# Altium schematic sheet ethernet.SchDoc
size A4; SheetNumber: 4; SheetTotal: 6
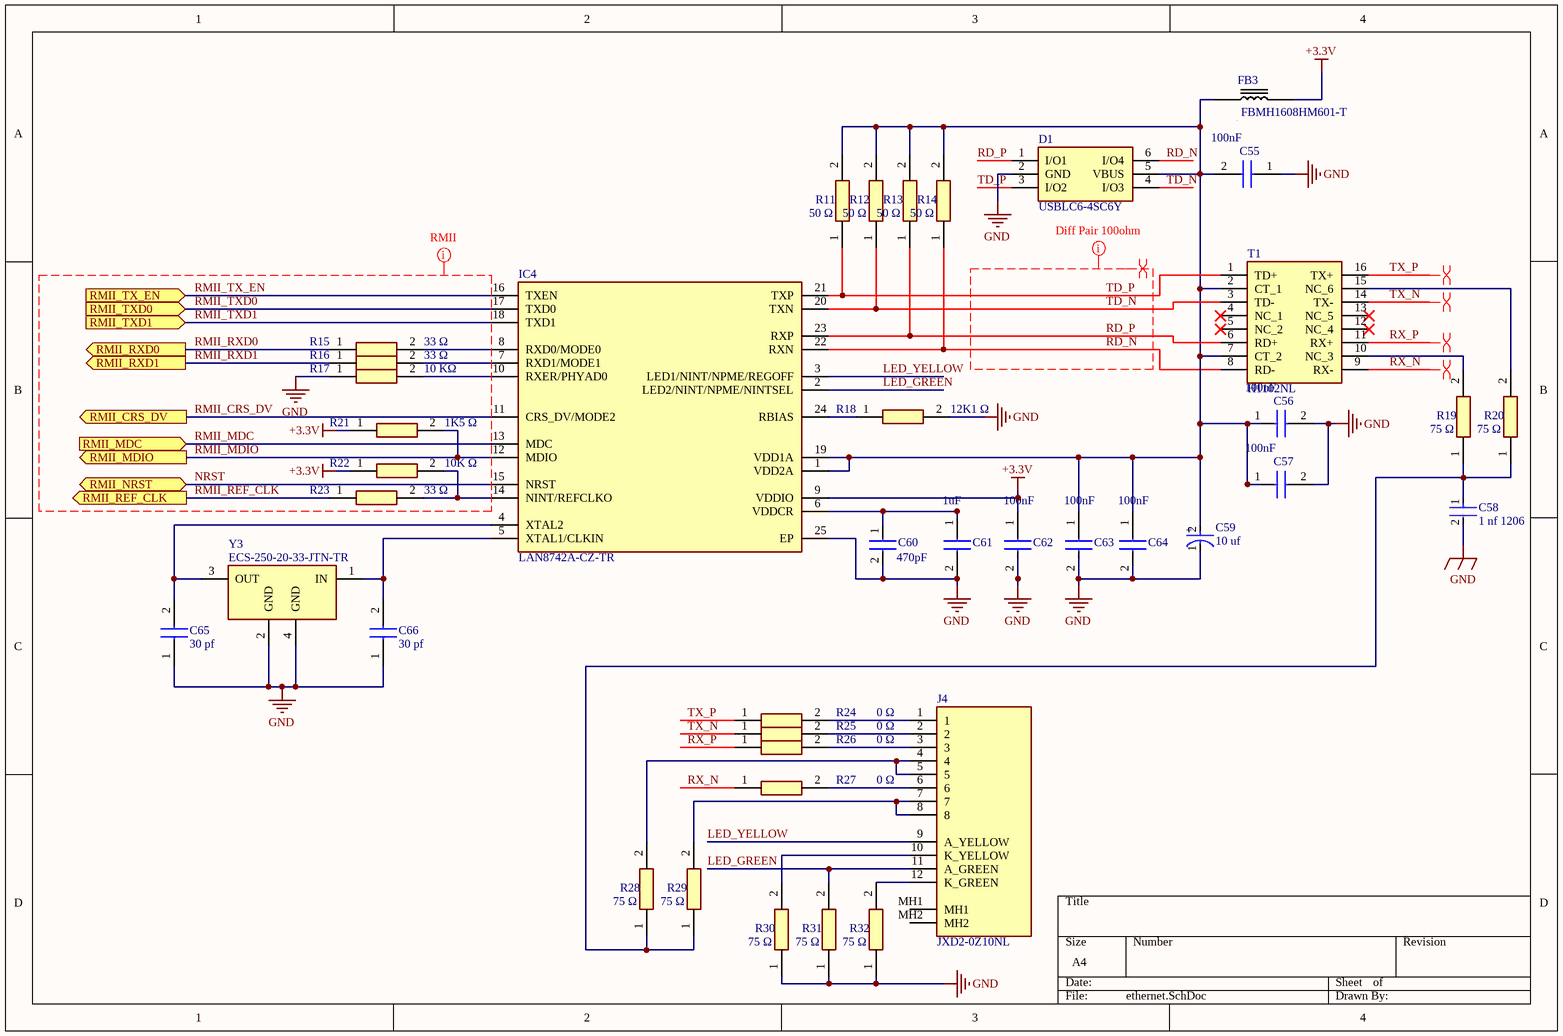
[diagram p0: ethernet.SchDoc]

## Parts
C55  value 100nF  [CAPC1608X87N]  (hidden comment: CGA3E2X7R1H104K080AA)
C56  value 100nF  [CAPC1608X87N]  (hidden comment: CGA3E2X7R1H104K080AA)
C57  value 100nF  [CAPC1608X87N]  (hidden comment: CGA3E2X7R1H104K080AA)
C58  1 nf 1206  [FP-CC1206-0_3-1_45-IPC_C]
C59  10 uf  [FP-T491D-MFG]
C60  value 470pF  [CAPC1005X55N]  (hidden comment: C0603C471J5GACTU)
C61  value 1uF  [CAPC1608X87N]  (hidden comment: 0603ZD105KAT2A)
C62  value 100nF  [CAPC1608X87N]  (hidden comment: CGA3E2X7R1H104K080AA)
C63  value 100nF  [CAPC1608X87N]  (hidden comment: CGA3E2X7R1H104K080AA)
C64  value 100nF  [CAPC1608X87N]  (hidden comment: CGA3E2X7R1H104K080AA)
C65  30 pf  [CAPC1608X87N]
C66  30 pf  [CAPC1608X87N]
D1  USBLC6-4SC6Y  [SOT95P280X145-6N]
FB3  FBMH1608HM601-T  [BEADC1608X90N]
IC4  LAN8742A-CZ-TR  [QFN50P400X400X100-25N-D]
J4  JXD2-0Z10NL  [JXD20Z10NL]
R11  50 Ω  [RESC1005X35N]
R12  50 Ω  [RESC1005X35N]
R13  50 Ω  [RESC1005X35N]
R14  50 Ω  [RESC1005X35N]
R15  33 Ω  [RESC1005X35N]
R16  33 Ω  [RESC1005X35N]
R17  10 KΩ  [RESC1005X35N]
R18  12K1 Ω  [RESC1005X35N]
R19  75 Ω  [RESC1005X35N]
R20  75 Ω  [RESC1005X35N]
R21  1K5 Ω  [RESC1005X35N]
R22  10K Ω  [RESC1005X35N]
R23  33 Ω  [RESC1005X35N]
R24  0 Ω  [RESC1005X35N]
R25  0 Ω  [RESC1005X35N]
R26  0 Ω  [RESC1005X35N]
R27  0 Ω  [RESC1005X35N]
R28  75 Ω  [RESC1005X35N]
R29  75 Ω  [RESC1005X35N]
R30  75 Ω  [RESC1005X35N]
R31  75 Ω  [RESC1005X35N]
R32  75 Ω  [RESC1005X35N]
T1  H1102NL  [SOIC127P940X597-16N]
Y3  ECS-250-20-33-JTN-TR  [ECS-250-20-33-JTN-TR]

## Ports
RMII_CRS_DV (out, see visual_tactile[3D], controller[3A]), RMII_MDC (in, see visual_tactile[3D], controller[4A]), RMII_MDIO (out, see visual_tactile[3D], controller[3A]), RMII_NRST (bidir, see visual_tactile[3D], controller[2D]), RMII_REF_CLK (out, see visual_tactile[3D], controller[3A]), RMII_RXD0 (out, see visual_tactile[3C], controller[4A]), RMII_RXD1 (out, see visual_tactile[3C], controller[4A]), RMII_TX_EN (in, see visual_tactile[3C], controller[3B]), RMII_TXD0 (in, see visual_tactile[3C], controller[3C]), RMII_TXD1 (in, see visual_tactile[3C], controller[3C])

## Nets
+3.3V: C62.1 FB3.2 IC4.9(VDDIO) R21.1 R22.1
GND: C55.1 C56.2 C57.2 C58.2 C59.1(C) C60.2 C61.2 C62.2 C63.2 C64.2 C65.1 C66.1 D1.2(GND) IC4.25(EP) R17.1 R18.2 R30.1 R31.1 R32.1 Y3.2(GND) Y3.4(GND)
LED_GREEN: IC4.2(LED2/NINT/NPME/NINTSEL) J4.11(A_GREEN) R31.2
LED_YELLOW: IC4.3(LED1/NINT/NPME/REGOFF) J4.9(A_YELLOW)
NRST: IC4.15(NRST) ; port RMII_NRST
RD_N: D1.6(I/O4) IC4.22(RXN) R14.1 T1.8(RD-)
RD_P: D1.1(I/O1) IC4.23(RXP) R13.1 T1.6(RD+)
RMII_CRS_DV: IC4.11(CRS_DV/MODE2) ; port RMII_CRS_DV
RMII_MDC: IC4.13(MDC) ; port RMII_MDC
RMII_MDIO: IC4.12(MDIO) R21.2 ; port RMII_MDIO
RMII_REF_CLK: R23.1 ; port RMII_REF_CLK
RMII_RXD0: R15.1 ; port RMII_RXD0
RMII_RXD1: R16.1 ; port RMII_RXD1
RMII_TX_EN: IC4.16(TXEN) ; port RMII_TX_EN
RMII_TXD0: IC4.17(TXD0) ; port RMII_TXD0
RMII_TXD1: IC4.18(TXD1) ; port RMII_TXD1
RX_N: R27.1 T1.9(RX-)
RX_P: R26.1 T1.11(RX+)
TD_N: D1.4(I/O3) IC4.20(TXN) R12.1 T1.3(TD-)
TD_P: D1.3(I/O2) IC4.21(TXP) R11.1 T1.1(TD+)
TX_N: R25.1 T1.14(TX-)
TX_P: R24.1 T1.16(TX+)
NetC55_2: C55.2 C56.1 C57.1 C59.2(A) C63.1 C64.1 D1.5(VBUS) FB3.1 IC4.1(VDD2A) IC4.19(VDD1A) R11.2 R12.2 R13.2 R14.2 T1.2(CT_1) T1.7(CT_2)
NetC58_1: C58.1 R19.1 R20.1 R28.1 R29.1
NetC60_1: C60.1 C61.1 IC4.6(VDDCR)
NetC65_2: C65.2 IC4.4(XTAL2) Y3.3(OUT)
NetC66_2: C66.2 IC4.5(XTAL1/CLKIN) Y3.1(IN)
NetIC4_7: IC4.7(RXD1/MODE1) R16.2
NetIC4_8: IC4.8(RXD0/MODE0) R15.2
NetIC4_10: IC4.10(RXER/PHYAD0) R17.2
NetIC4_14: IC4.14(NINT/REFCLKO) R22.2 R23.2
NetIC4_24: IC4.24(RBIAS) R18.1
NetJ4_1: J4.1 R24.2
NetJ4_2: J4.2 R25.2
NetJ4_3: J4.3 R26.2
NetJ4_4: J4.4 J4.5 R28.2
NetJ4_6: J4.6 R27.2
NetJ4_7: J4.7 J4.8 R29.2
NetJ4_10: J4.10(K_YELLOW) R30.2
NetJ4_12: J4.12(K_GREEN) R32.2
NetR19_2: R19.2 T1.10(NC_3)
NetR20_2: R20.2 T1.15(NC_6)

Not connected (* = marked no-connect by the designer): J4 MH1 MH2; T1 4(NC_1)* 5(NC_2)* 12(NC_4)* 13(NC_5)*

## Layout directives
rule Matched Net Lengths [Tolerance = 100mil]: RD_N, RD_P, TD_N, TD_P
differential pair: RD_N, RD_P, RX_N, RX_P, TD_N, TD_P, TX_N, TX_P
rule Matched Net Lengths [Delay Tolerance = 100ps]; rule Impedance Constraint [Min = 47.00    Max = 53.00    ]: +3.3V, GND, NRST, RMII_CRS_DV, RMII_MDC, RMII_MDIO, RMII_REF_CLK, RMII_RXD0, RMII_RXD1, RMII_TX_EN, RMII_TXD0, RMII_TXD1

## Notes on the sheet
- (in symbol CMP-2000-07200-2) +

## Library data of the parts
C55-C57 C62-C64 = C0603C300J5GACTU: Ceramic Capacitor, Multilayer, Ceramic, 50V, 10% +Tol, 10% -Tol, X7R, 15% TC, 0.1uF, Surface Mount, 0603; Manufacturer_Name: KEMET; Manufacturer: TDK; Multilayer: Yes; Reference Standard: AEC-Q200; Datasheet Link: https://content.kemet.com/datasheets/KEM_C1003_C0G_SMD.pdf; Height: 0.87mm; Manufacturer_Part_Number: C0603C300J5GACTU; Mouser Part Number: 80-C0603C300J5G; Mouser Price/Stock: https://www.mouser.co.uk/ProductDetail/KEMET/C0603C300J5GACTU?qs=KQYYlyH3z3RpeXhtJmCcMA%3D%3D; Arrow Part Number: C0603C300J5GACTU; Arrow Price/Stock: https://www.arrow.com/en/products/c0603c300j5gactu/kemet-corporation; Supplier: Rs; Supplier Part Number: 7882985P; Manufacturer Part Number: CGA3E2X7R1H104K080AA; RoHS: Yes; Category: Ceramic Capacitors; Stock: 84850; Pricing: 250=0.042, 500=0.039, 1000=0.037, 2500=0.033 (EUR); Mounting Technology: Surface Mount; Pins: 2; Dielectric Material: Ceramic; Package Shape: Rectangular; Case/Package: 0603; Terminal Finish: Nickel; Min Operating Temperature: -55°C; Max Operating Temperature: 125°C; JESD-609 Code: e3; Capacitor Type: Ceramic; Tolerance  (fill in as +-): 10%; Package Style: SMTMeter; Packaging: Tape and Reel; Tolerance (fill in as +-): 10%; Rated DC Voltage (URdc): 50V; Temperature Characteristics Code: X7R; Termination: Wraparound; Length: 1.6mm; Width: 0.8mm; Reach SVHC Compliant: Yes; RoHS Compliant: Yes; ComponentLink1URL: https://datasheet.ciiva.com:443/pdfs/VipMasterIC/IC/TDKC/TDKC-S-A0008953915/TDKC-S-A0008953915-1.pdf?src-supplier=IHS+Markit; ComponentLink1Description: https://datasheet.ciiva.com:443/pdfs/VipMasterIC/IC/TDKC/TDKC-S-A0008953915/TDKC-S-A0008953915-1.pdf?src-supplier=IHS+Markit
C58 = CMP-2000-05436-2: CAP CER 1000PF 2KV X7R 1206; Capacitance: 1nF; Insulation Resistance: 10GR; Dissipation Factor: 2.5%; Tolerance: 10%; Termination: SMD/SMT; Voltage Rating (DC): 2kV; Case/Package: 1206; Length: 3.2mm; Depth: 1.6mm; Case Code (Imperial): 1206; Package Quantity: 1; Packaging: Tape and Reel; Dielectric: X7R; Mount: Surface Mount; Max Operating Temperature: 125°C; Lead Free: Lead Free; Number of Pins: 2; Thickness: 0.057inch; Width: 0.063inch; Resistor Type: Ceramic; Series: CC; RoHS Compliant: Yes; Voltage Rating: 2kV; Radiation Hardening: No; Construction: Flat; Height: 1.25mm; Min Operating Temperature: -55°C; Voltage: 2kV; Case Code (Metric): 3216
C59 = CMP-2000-07200-2: CAP TANT 10UF 10% 25V 2917; Tolerance: 20%; Life (Hours): 2000Hour; Dielectric Material: Tantalum; Dissipation Factor: 6%; Leakage Current: 2.5uA; Ripple Current: 387mA; Polarity: Polar; ESR (Equivalent Series Resistance): 1R; Voltage: 25V; Capacitance: 10uF; Voltage Rating: 25V; Voltage Rating (DC): 25V; Depth: 4.3mm; Mount: Surface Mount; Length: 7.3mm; Termination: SMD/SMT; Radiation Hardening: No; Max Operating Temperature: 125°C; REACH SVHC: No SVHC; Height: 2.8mm; Package Quantity: 1; Packaging: Tape and Reel; Case Code (Imperial): 2917; Width: 4.3mm; Min Operating Temperature: -55°C; Features: General Purpose; Case Code (Metric): 7343; Height - Seated (Max): 0.122inch; Number of Pins: 2; Lead Free: Lead Free; Case/Package: 2917
C60 = CC0402KRX7R7BB104: Ceramic Capacitor, Multilayer, Ceramic, 50V, 5% +Tol, 5% -Tol, C0G, 30ppm/Cel TC, 0.00047uF, Surface Mount, 0603; Manufacturer_Name: KEMET; Manufacturer: Murata; Manufacturer Part Number: GRM1555C1H471JA01D; Multilayer: Yes; Datasheet Link: http://www.datasheets360.com/pdf/-5354154806277341459; Height: 0.55mm; Manufacturer_Part_Number: CC0402KRX7R7BB104; Mouser Part Number: 603-CC402KRX7R7BB104; Mouser Price/Stock: https://www.mouser.co.uk/ProductDetail/YAGEO/CC0402KRX7R7BB104?qs=AgBp2OyFlx%252BSOyhfyS7hpw%3D%3D; Arrow Part Number: CC0402KRX7R7BB104; Arrow Price/Stock: https://www.arrow.com/en/products/cc0402krx7r7bb104/yageo?region=nac; Supplier: Mouser; Supplier Part Number: 81-GRM1555C1H471JA01; RoHS: Yes; Category: Ceramic Capacitors; Stock: 427132; Pricing: 1=0.1, 10=0.023, 50=0.023, 100=0.012, 1000=0.009, 10000=0.006 (USD); Mounting Technology: Surface Mount; Pins: 2; Dielectric Material: Ceramic; Package Shape: Rectangular; Case/Package: 0402; Terminal Finish: Nickel; Min Operating Temperature: -55°C; Max Operating Temperature: 125°C; JESD-609 Code: e3; Capacitor Type: Ceramic; Tolerance  (fill in as +-): 5%; Package Style: SMTMeter; Packaging: Tape and Reel; Tolerance (fill in as +-): 5%; Rated DC Voltage (URdc): 50V; Temperature Characteristics Code: C0G; Termination: Wraparound; Length: 1mm; Width: 0.5mm; Reach SVHC Compliant: Yes; RoHS Compliant: Yes; ComponentLink1URL: https://psearch.en.murata.com:443/capacitor/product/GRM1555C1H471JA01%23.pdf?src-supplier=IHS+Markit; ComponentLink1Description: https://psearch.en.murata.com:443/capacitor/product/GRM1555C1H471JA01%23.pdf?src-supplier=IHS+Markit; ComponentLink2URL: https://datasheet.ciiva.com/18184/getdatasheetpartid-178845-18184393.pdf?src-supplier=Verical; ComponentLink2Description: https://datasheet.ciiva.com/18184/getdatasheetpartid-178845-18184393.pdf?src-supplier=Verical; ComponentLink3URL: https://datasheet.ciiva.com/7828/4360-7828869.pdf?src-supplier=Element14; ComponentLink3Description: https://datasheet.ciiva.com/7828/4360-7828869.pdf?src-supplier=Element14; ComponentLink4URL: https://datasheet.ciiva.com/132/partnumbering-e-01-132216.pdf?src-supplier=Digikey; ComponentLink4Description: https://datasheet.ciiva.com/132/partnumbering-e-01-132216.pdf?src-supplier=Digikey; ComponentLink5URL: https://datasheet.ciiva.com/132/partnumbering-e-01-132215.pdf?src-supplier=Digikey; ComponentLink5Description: https://datasheet.ciiva.com/132/partnumbering-e-01-132215.pdf?src-supplier=Digikey; ComponentLink6URL: https://datasheet.ciiva.com/132/partnumbering-e-01-132217.pdf?src-supplier=Digikey; ComponentLink6Description: https://datasheet.ciiva.com/132/partnumbering-e-01-132217.pdf?src-supplier=Digikey; ComponentLink7URL: https://datasheet.ciiva.com/7828/4360-7828871.pdf?src-supplier=Element14; ComponentLink7Description: https://datasheet.ciiva.com/7828/4360-7828871.pdf?src-supplier=Element14; ComponentLink8URL: https://datasheet.ciiva.com:443/pdfs/VipMasterIC/IC/KEME/KEME-S-A0007731554/KEME-S-A0007723451-1.pdf?src-supplier=IHS+Markit; ComponentLink8Description: https://datasheet.ciiva.com:443/pdfs/VipMasterIC/IC/KEME/KEME-S-A0007731554/KEME-S-A0007723451-1.pdf?src-supplier=IHS+Markit
C61 = C0603C300J5GACTU: Ceramic Capacitor, Multilayer, Ceramic, 10V, 10% +Tol, 10% -Tol, X5R, 15% TC, 1uF, Surface Mount, 0603; Manufacturer_Name: KEMET; Manufacturer: Kyocera AVX; Multilayer: Yes; Datasheet Link: https://content.kemet.com/datasheets/KEM_C1003_C0G_SMD.pdf; Height: 0.87mm; Manufacturer_Part_Number: C0603C300J5GACTU; Mouser Part Number: 80-C0603C300J5G; Mouser Price/Stock: https://www.mouser.co.uk/ProductDetail/KEMET/C0603C300J5GACTU?qs=KQYYlyH3z3RpeXhtJmCcMA%3D%3D; Arrow Part Number: C0603C300J5GACTU; Arrow Price/Stock: https://www.arrow.com/en/products/c0603c300j5gactu/kemet-corporation; Supplier: Arrow Electronics; Supplier Part Number: 0603ZD105KAT2A; Manufacturer Part Number: 0603ZD105KAT2A; RoHS: Yes; Category: Ceramic Capacitors; Stock: 612000; Pricing: 4000=0.0155, 8000=0.014, 12000=0.0136, 20000=0.0135, 24000=0.0127, 100000=0.009 (USD); Mounting Technology: Surface Mount; Pins: 2; Dielectric Material: Ceramic; Package Shape: Rectangular; Case/Package: 0603; Terminal Finish: Nickel; Min Operating Temperature: -55°C; Max Operating Temperature: 85°C; JESD-609 Code: e3; Capacitor Type: Ceramic; Tolerance  (fill in as +-): 10%; Package Style: SMTMeter; Packaging: Tape and Reel; Tolerance (fill in as +-): 10%; Rated DC Voltage (URdc): 10V; Temperature Characteristics Code: X5R; Termination: Wraparound; Length: 1.6mm; Width: 0.81mm; Reach SVHC Compliant: Yes; RoHS Compliant: Yes; ComponentLink1URL: https://datasheet.ciiva.com:443/pdfs/VipMasterIC/IC/AVXC/AVXC-S-A0009640604/AVXC-S-A0009640604-1.pdf?src-supplier=IHS+Markit; ComponentLink1Description: https://datasheet.ciiva.com:443/pdfs/VipMasterIC/IC/AVXC/AVXC-S-A0009640604/AVXC-S-A0009640604-1.pdf?src-supplier=IHS+Markit; ComponentLink2URL: https://datasheet.ciiva.com/11787/0900766b80a45521-11787469.pdf?src-supplier=Rs; ComponentLink2Description: https://datasheet.ciiva.com/11787/0900766b80a45521-11787469.pdf?src-supplier=Rs; ComponentLink3URL: https://datasheet.ciiva.com/150/cx5r-150308.pdf?src-supplier=Digikey; ComponentLink3Description: https://datasheet.ciiva.com/150/cx5r-150308.pdf?src-supplier=Digikey; ComponentLink4URL: https://datasheet.ciiva.com/150/cx5r-150309.pdf?src-supplier=Digikey; ComponentLink4Description: https://datasheet.ciiva.com/150/cx5r-150309.pdf?src-supplier=Digikey; ComponentLink5URL: https://datasheet.ciiva.com/150/cx5r-150310.pdf?src-supplier=Digikey; ComponentLink5Description: https://datasheet.ciiva.com/150/cx5r-150310.pdf?src-supplier=Digikey; ComponentLink6URL: https://datasheet.ciiva.com/6128/84508-6128747.pdf?src-supplier=Farnell; ComponentLink6Description: https://datasheet.ciiva.com/6128/84508-6128747.pdf?src-supplier=Farnell; ComponentLink7URL: https://datasheet.ciiva.com/11462/cx5r-11462907.pdf?src-supplier=Avnet; ComponentLink7Description: https://datasheet.ciiva.com/11462/cx5r-11462907.pdf?src-supplier=Avnet; ComponentLink8URL: https://datasheet.ciiva.com/2987/cx5r-2987907.pdf?src-supplier=Avnet; ComponentLink8Description: https://datasheet.ciiva.com/2987/cx5r-2987907.pdf?src-supplier=Avnet; ComponentLink9URL: https://datasheet.ciiva.com/16200/cx5r-16200364.pdf?src-supplier=Future+Electronics; ComponentLink9Description: https://datasheet.ciiva.com/16200/cx5r-16200364.pdf?src-supplier=Future+Electronics; ComponentLink10URL: https://datasheet.ciiva.com/14604/70001028-14604907.pdf?src-supplier=Allied+Electronics; ComponentLink10Description: https://datasheet.ciiva.com/14604/70001028-14604907.pdf?src-supplier=Allied+Electronics; ComponentLink11URL: https://datasheet.ciiva.com/1458/1666675-1458205.pdf?src-supplier=Element14; ComponentLink11Description: https://datasheet.ciiva.com/1458/1666675-1458205.pdf?src-supplier=Element14; ComponentLink12URL: https://datasheet.ciiva.com/1458/1666675-1458206.pdf?src-supplier=Element14; ComponentLink12Description: https://datasheet.ciiva.com/1458/1666675-1458206.pdf?src-supplier=Element14; ComponentLink13URL: https://datasheet.ciiva.com/1458/84508-1458207.pdf?src-supplier=Element14; ComponentLink13Description: https://datasheet.ciiva.com/1458/84508-1458207.pdf?src-supplier=Element14; ComponentLink14URL: https://datasheet.ciiva.com/7855/1666675-7855113.pdf?src-supplier=Element14; ComponentLink14Description: https://datasheet.ciiva.com/7855/1666675-7855113.pdf?src-supplier=Element14
C65 C66 = C0603C300J5GACTU: Ceramic Capacitor, Multilayer, Ceramic, 50V, 5% +Tol, 5% -Tol, C0G, 30ppm/Cel TC, 0.00003uF, Surface Mount, 0603; Manufacturer_Name: KEMET; Value: 30pF; Multilayer: Yes; Datasheet Link: https://content.kemet.com/datasheets/KEM_C1003_C0G_SMD.pdf; Height: 0.87mm; Manufacturer_Part_Number: C0603C300J5GACTU; Mouser Part Number: 80-C0603C300J5G; Mouser Price/Stock: https://www.mouser.co.uk/ProductDetail/KEMET/C0603C300J5GACTU?qs=KQYYlyH3z3RpeXhtJmCcMA%3D%3D; Arrow Part Number: C0603C300J5GACTU; Arrow Price/Stock: https://www.arrow.com/en/products/c0603c300j5gactu/kemet-corporation; Supplier: Mouser; Supplier Part Number: 80-C0603C300J5G; Manufacturer: KEMET; Manufacturer Part Number: C0603C300J5GACTU; RoHS: Yes; Category: Ceramic Capacitors; Stock: 135157; Pricing: 1=0.1, 10=0.032, 50=0.032, 100=0.016, 1000=0.011, 10000=0.008 (USD); Mounting Technology: Surface Mount; Pins: 2; Dielectric Material: Ceramic; Package Shape: Rectangular; Case/Package: 0603; Terminal Finish: Nickel; Min Operating Temperature: -55°C; Max Operating Temperature: 125°C; JESD-609 Code: e3; Capacitor Type: Ceramic; Tolerance  (fill in as +-): 5%; Package Style: SMTMeter; Packaging: Tape and Reel; Tolerance (fill in as +-): 5%; Rated DC Voltage (URdc): 50V; Temperature Characteristics Code: C0G; Termination: Wraparound; Length: 1.6mm; Width: 0.8mm; Reach SVHC Compliant: Yes; RoHS Compliant: Yes; ComponentLink1URL: https://datasheet.ciiva.com:443/pdfs/VipMasterIC/IC/KEME/KEME-S-A0005605168/KEME-S-A0005605168-1.pdf?src-supplier=IHS+Markit; ComponentLink1Description: https://datasheet.ciiva.com:443/pdfs/VipMasterIC/IC/KEME/KEME-S-A0005605168/KEME-S-A0005605168-1.pdf?src-supplier=IHS+Markit; ComponentLink2URL: https://datasheet.ciiva.com/22700/1691965-22700853.pdf?src-supplier=Element14; ComponentLink2Description: https://datasheet.ciiva.com/22700/1691965-22700853.pdf?src-supplier=Element14; ComponentLink3URL: https://datasheet.ciiva.com/5420/kem-c1003-c0g-smd-356956-5420875.pdf?src-supplier=Mouser; ComponentLink3Description: https://datasheet.ciiva.com/5420/kem-c1003-c0g-smd-356956-5420875.pdf?src-supplier=Mouser
D1 = USBLC6-4SC6Y: Diode ESD (Uni-directional); Manufacturer_Name: STMicroelectronics; Datasheet Link: https://www.st.com/resource/en/datasheet/usblc6-4sc6y.pdf; Height: 1.45mm; Manufacturer_Part_Number: USBLC6-4SC6Y; Mouser Part Number: 511-USBLC6-4SC6Y; Mouser Price/Stock: https://www.mouser.co.uk/ProductDetail/STMicroelectronics/USBLC6-4SC6Y?qs=gNDSiZmRJS%252B5K%252Bxjl%252Bw9xw%3D%3D; Arrow Part Number: USBLC6-4SC6Y; Arrow Price/Stock: https://www.arrow.com/en/products/usblc6-4sc6y/stmicroelectronics?region=nac
FB3 = FBMH1608HM601-T: Ferrite Bead; Manufacturer_Name: TAIYO YUDEN; Datasheet Link: https://componentsearchengine.com/Datasheets/2/FBMH1608HM601-T.pdf; Height: 0.9mm; Manufacturer_Part_Number: FBMH1608HM601-T; Mouser Part Number: 963-FBMH1608HM601-T; Mouser Price/Stock: https://www.mouser.co.uk/ProductDetail/Taiyo-Yuden/FBMH1608HM601-T?qs=I6KAKw0tg2y6O4cu0afp%252BA%3D%3D; Arrow Part Number: FBMH1608HM601-T; Arrow Price/Stock: https://www.arrow.com/en/products/fbmh1608hm601-t/taiyo-yuden
IC4 = LAN8742A-CZ-TR: Integrated Circuit; Manufacturer_Name: Microchip; Datasheet Link: http://ww1.microchip.com/downloads/en/DeviceDoc/8742a.pdf; Height: 1mm; Manufacturer_Part_Number: LAN8742A-CZ-TR; Mouser Part Number: 579-LAN8742A-CZ-TR; Mouser Price/Stock: https://www.mouser.co.uk/ProductDetail/Microchip-Technology/LAN8742A-CZ-TR?qs=6qKXPk0vzx0Y6uPCt7MXWw%3D%3D; Arrow Part Number: LAN8742A-CZ-TR; Arrow Price/Stock: https://www.arrow.com/en/products/lan8742a-cz-tr/microchip-technology?region=nac
J4 = JXD2-0Z10NL: Conn Jack 1PORT 100 Base-tx Pcb; Manufacturer_Name: Pulse Electronics; Manufacturer: Pulse; Datasheet Link: https://productfinder.pulseelectronics.com/api/open/product-attachments/datasheet/jxd2-0z10nl; Height: 17.2mm; Manufacturer_Part_Number: JXD2-0Z10NL; Mouser Part Number: 673-JXD2-0Z10NL; Mouser Price/Stock: https://www.mouser.co.uk/ProductDetail/Pulse-Electronics/JXD2-0Z10NL?qs=MyNHzdoqoQKKbi0V%2FxsyPg%3D%3D; Arrow Part Number: JXD2-0Z10NL; Arrow Price/Stock: https://www.arrow.com/en/products/jxd2-0z10nl/pulse-electronics-corporation?region=europe; Supplier: Farnell; Supplier Part Number: 4058812; Manufacturer Part Number: JXD2-0Z10NL; RoHS: No; Category: Modular / Ethernet Connectors; Stock: 762; Pricing: 1=6, 10=5.17, 25=4.94, 50=4.69, 100=4.46, 500=4.21 (EUR); ComponentLink1URL: https://datasheet.octopart.com/JXD2-0Z10NL-Pulse-datasheet-165161310.pdf?src-supplier=Sager+Electronics; ComponentLink1Description: https://datasheet.octopart.com/JXD2-0Z10NL-Pulse-datasheet-165161310.pdf?src-supplier=Sager+Electronics
R11-R32 = CPF0402B100KE: Resistor; Manufacturer_Name: TE Connectivity; Datasheet Link: http://www.farnell.com/datasheets/1786775.pdf; Height: 0.35mm; Manufacturer_Part_Number: CPF0402B100KE; Mouser Part Number: 279-CPF0402B100KE; Mouser Price/Stock: https://www.mouser.co.uk/ProductDetail/TE-Connectivity-Holsworthy/CPF0402B100KE?qs=CXI0wBT1M2h4W2Gm72yIGA%3D%3D; Arrow Part Number: CPF0402B100KE; Arrow Price/Stock: https://www.arrow.com/en/products/cpf0402b100ke/te-connectivity?region=nac
T1 = H1102NL: Transformer; Manufacturer_Name: Pulse Electronics; Datasheet Link: https://productfinder.pulseeng.com/products/datasheets/h1102nl.pdf; Height: 5.97mm; Manufacturer_Part_Number: H1102NL; Mouser Part Number: 673-H1102NL; Mouser Price/Stock: https://www.mouser.co.uk/ProductDetail/Pulse-Electronics/H1102NL?qs=EKu32SdDin%2FHU33L94JZxw%3D%3D; Arrow Part Number: H1102NL; Arrow Price/Stock: https://www.arrow.com/en/products/h1102nl/pulse-electronics-corporation?region=europe
Y3 = ECS-250-20-33-JTN-TR: Crystal or Oscillator; Manufacturer_Name: RALTRON; Manufacturer_Part_Number: CO4605-100.000-T-TR; Datasheet Link: http://www.raltron.com//wp-content/uploads/2018/12/clock_co43_46_Series-updated.pdf; Height: 1.8mm